# Altium schematic sheet ITCoffeeOne_Lite_V4.02_0.SchDoc: GaggiaBoard_V3
size 274 x 227 mm; Origin: Eagle; Date: 2023-10-17 12:57:02; SheetNumber: 1; GateName_1: G$1; SymbolName_1: LETTER_L; LibraryName: frames; DeviceSetName: LETTER_L; GateName_2: G$2; SymbolName_2: DOCFIELD; Sheet: Sheet:; REV: REV:
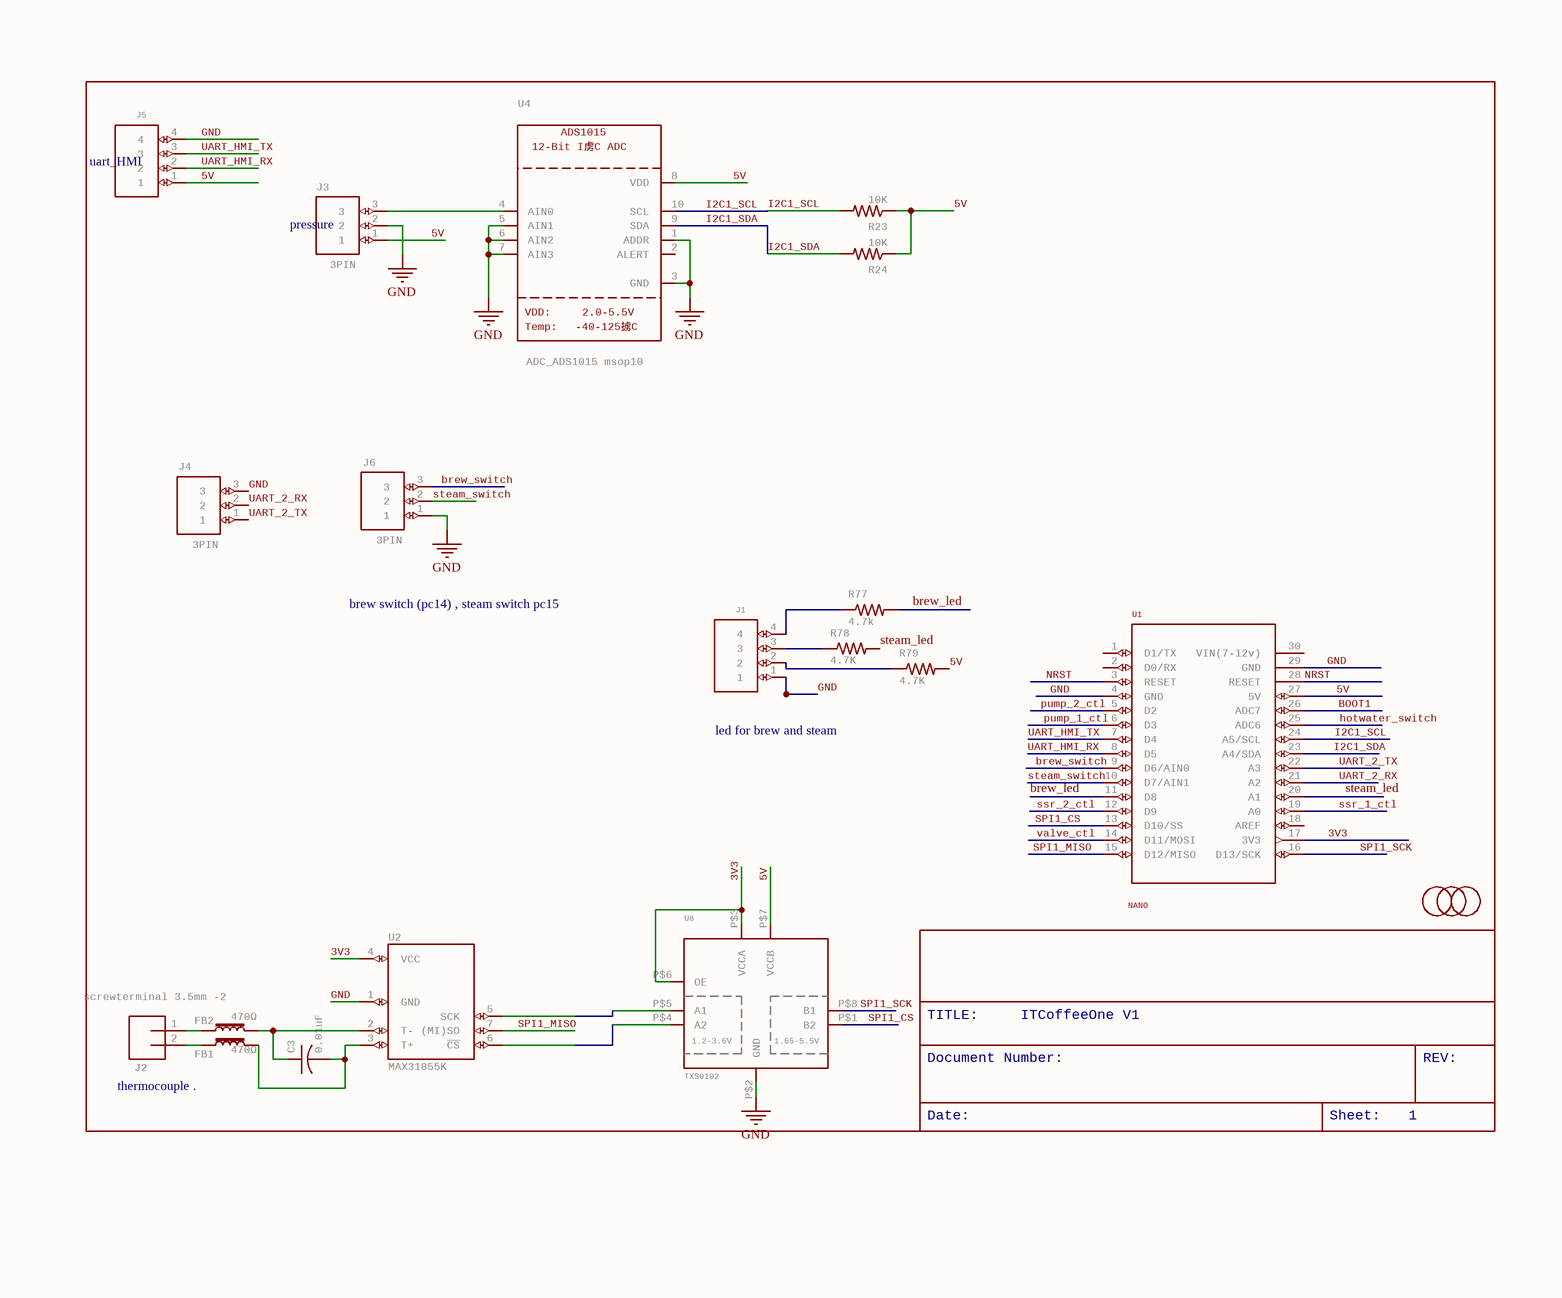
[diagram p0: ITCoffeeOne_Lite_V4.02_0.SchDoc]

## Parts
C3  0.01uF  [C0603]
FB1  470Ω  [0603]
FB2  470Ω  [0603]
J1  4PIN B4B-PH-K-S  [B4B-PH-K-S]  (value not drawn)
J2  screwterminal 3.5mm -2  [SCREWTERMINAL-3.5MM-2-NS]
J3  3PIN  [B3B-PH-K-S]
J4  3PIN  [B3B-PH-K-S]
J5  4PIN B4B-PH-K-S  [B4B-PH-K-S]  (value not drawn)
J6  3PIN  [B3B-PH-K-S]
MARK1  FIDUCIAL  [FIDUCIAL_1MM]  (value not drawn)
MARK2  FIDUCIAL  [FIDUCIAL_1MM]  (value not drawn)
MARK5  FIDUCIAL  [FIDUCIAL_1MM]  (value not drawn)
R23  10K  [R0603]
R24  10K  [R0603]
R77  4.7k  [R0603]
R78  4.7K  [R0603]
R79  4.7K  [R0603]
U1  NANO  [ARDUINO NANO]
U2  MAX31855K  [SO08]
U4  ADC_ADS1015 msop10  12-BitI虏CADC: 12-Bit I虏C ADC  VDD: VDD:  Temp: Temp:  [MSOP10]
U8  TXS0102  [VFSOP-8]

## Nets
GND: J1.1 J3.2 J4.3 J5.4 J6.1 U1.4(GND) U1.29(GND) U2.1(GND) U4.1(ADDR) U4.3(GND) U4.5(AIN1) U4.6(AIN2) U4.7(AIN3) U8.P$2(GND)
3V3: U1.17(3V3) U2.4(VCC) U8.P$3(VCCA) U8.P$6(OE)
5V: J3.1 J5.1 R23.1 R24.1 R79.2 U1.27(5V) U4.8(VDD) U8.P$7(VCCB)
BOOT1: U1.26(ADC7)
brew_led: R77.2 U1.11(D8)
brew_switch: J6.3 U1.9(D6/AIN0)
hotwater_switch: U1.25(ADC6)
I2C1_SCL: R23.2 U1.24(A5/SCL) U4.10(SCL)
I2C1_SDA: R24.2 U1.23(A4/SDA) U4.9(SDA)
NRST: U1.3(RESET) U1.28(RESET)
pump_1_ctl: U1.6(D3)
pump_2_ctl: U1.5(D2)
SPI1_CS: U1.13(D10/SS) U8.P$1(B2)
SPI1_MISO: U1.15(D12/MISO) U2.7((MI)SO)
SPI1_SCK: U1.16(D13/SCK) U8.P$8(B1)
ssr_1_ctl: U1.19(A0)
ssr_2_ctl: U1.12(D9)
steam_led: R78.2 U1.20(A1)
steam_switch: J6.2 U1.10(D7/AIN1)
UART_2_RX: J4.2 U1.21(A2)
UART_2_TX: J4.1 U1.22(A3)
UART_HMI_RX: J5.2 U1.8(D5)
UART_HMI_TX: J5.3 U1.7(D4)
valve_ctl: U1.14(D11/MOSI)
NetC3_1: C3.1 FB2.2 U2.2(T-)
NetC3_2: C3.2 FB1.2 U2.3(T+)
NetFB1_1: FB1.1 J2.2
NetFB2_1: FB2.1 J2.1
NetJ1_2: J1.2 R79.1
NetJ1_3: J1.3 R78.1
NetJ1_4: J1.4 R77.1
NetJ3_3: J3.3 U4.4(AIN0)
NetU2_5: U2.5(SCK) U8.P$5(A1)
NetU2_6: U2.6(~{CS}) U8.P$4(A2)

Not connected (* = marked no-connect by the designer): U1 1(D1/TX) 2(D0/RX) 18(AREF) 30(VIN(7-12v)); U4 2(ALERT)

## Notes on the sheet
- (near J5) uart_HMI
- (near J3) pressure
- brew switch (pc14) , steam switch pc15
- led for brew and steam
- TITLE:
- ITCoffeeOne V1
- thermocouple .
- Document Number:
- REV:
- Date:
- Sheet:
- 1

## Library data of the parts
C3 = C-USC0603: CAPACITOR, American symbol; GateName_1: G$1; SymbolName_1: C-US; POPULARITY: 37; DeviceName: C0603; LibraryName: rcl; DeviceSetName: C-US; LCSC: C100042; SPICEPREFIX: C
FB1 FB2 = FERRITE_BEAD-0603-470Ω-100MHZ-1A-200MILIΩ: Ferrite Bead (blocks, cores, rings, chokes, etc.)    Inductor with layers of ferrite used to suppress high frequencies. Often used to isolate high frequency noise.   SparkFun Products:  IOIO-OTG - V2.2  SparkFun SAMD21 Mini Breakout  SparkFun 6 Degrees of Freedom Breakout - LSM6DS3  SparkFun SAMD21 Dev Breakout; GateName_1: G$1; PROD_ID: NDUC-12579; SymbolName_1: FERRITE_BEAD; DeviceName: -0603-470Ω-100MHZ-1A-200MILIΩ; LibraryName: SparkFun-Coils; DeviceSetName: FERRITE_BEAD; LCSC: C883591
J1 J5 = 4PIN: GateName_1: G$1; SymbolName_1: 4PIN; LibraryName: jst_eph; DeviceSetName: 4PIN; LCSC: C131334
J2 = CONN_023.5MM-NO_SILK: Multi connection point. Often used as Generic Header-pin footprint for 0.1 inch spaced/style header connections    On any of the 0.1 inch spaced packages, you can populate with these:  Break Away Headers - Straight (PRT-00116)   Break Away Male Headers - Right Angle (PRT-00553)   Female Headers (PRT-00115)   Break Away Headers - Machine Pin (PRT-00117)   Break Away Female Headers - Swiss Machine Pin (PRT-00743)        For SCREWTERMINALS and SPRING TERMINALS visit here:  Screw Terimnals on SparkFun.com (5mm/3.5mm/2.54mm spacing)       This device is also useful as a general connection point to wire up your design to another part of your project. Our various solder wires solder well into these plated through hole pads.  Hook-Up Wire - Assortment (Stranded, 22 AWG) (PRT-11375)   Hook-Up Wire - Assortment (Solid Core, 22 AWG) (PRT-11367)   View the entire wire category on our website here          Special notes: Molex polarized connector foot print use with: PRT-08233 with associated crimp pins and housings.  2.54_SCREWTERM for use with  PRT-10571.  3.5mm Screw Terminal footprints for  PRT-08084  5mm Screw Terminal footprints for use with PRT-08432; GateName_1: G$1; PROD_ID: CONN-08399; SymbolName_1: CONN_02; DeviceName: 3.5MM-NO_SILK; LibraryName: SparkFun-Connectors; DeviceSetName: CONN_02; LCSC: C474892
J3 = 3PIN: GateName_1: G$1; SymbolName_1: 3PIN; LibraryName: jst_eph; DeviceSetName: 3PIN; LCSC: C131339
J4 J6 = 3PIN: jst connector，3pin,2.0mm; GateName_1: G$1; SymbolName_1: 3PIN; LibraryName: jst_eph; DeviceSetName: 3PIN; LCSC: C131339
MARK1 MARK2 MARK5 = FIDUCIAL: For use by pick and place machines to calibrate the vision/machine, 1mm    By microbuilder.eu; GateName_1: G$1; SymbolName_1: DOT; LibraryName: adafruit; DeviceSetName: FIDUCIAL
R23 R24 R77-R79 = R-US_R0603: RESISTOR, American symbol; GateName_1: G$1; SymbolName_1: R-US; DeviceSetName: R-US_; POPULARITY: 77; DeviceName: R0603; LibraryName: rcl; LCSC: C98220; SPICEPREFIX: R
U1 = arduino nano: GateName_1: G$1; SymbolName_1: NANO; LibraryName: discrete; DeviceSetName: NANO
U2 = MAX31855K: Cold-Junction-Compensated K-Thermocoupleto-Digital Converter (-270掳C to +1800掳C)    The MAX31855K performs cold-junction compensation and digitizes the signal from a type-K thermocouple. The data is output in a 14-bit resolution, SPI鈩?compatible, read-only format. This converter resolves temperatures to 0.25掳C, allows readings as high as +1800掳C and as low as -270掳C, and exhibits thermocouple accuracy of 卤2掳C for temperatures ranging from -200掳C to +700掳C for K-type thermocouples.   Datasheet SparkFun Products  SparkFun Thermocouple Breakout - MAX31855K (SEN-13266); GateName_1: G$1; PROD_ID: IC-12578; SymbolName_1: MAX31855K; LibraryName: SparkFun-IC-Conversion; DeviceSetName: MAX31855K; LCSC: C52028
U4 = ADC_ADS1015: ADS1015 - 12-bit 4-Channel I2C ADC with Internal PGA    VDD: 2.0-5.5V  Sampling Rate: 3.3ksps  Gain Settings: 2/3, 1, 2, 4, 8, 16  I2C Address: ADDR low = 1001000x, ADDR high = 1001001x       Internal Comparator   The ADS1015 includes an internal comparator that can be set to output a high-level on ALERT when the conversion results exceeeds a pre-defined upper level, and will deassert itself when the level falls below a pre-defined lower threshold level. It can also be set to windowed mode where the ALERT pin will be asserted if the data exceeds the upper threshold or falls below the lower threshold.; GateName_1: G$1; SymbolName_1: ADS1015; LibraryName: microbuilder; DeviceSetName: ADC_ADS1015; ADS1015: ADS1015; 2.0-5.5V: 2.0-5.5V; -40-125掳C: -40-125掳C; LCSC: C193969
U8 = TXS0102: 2-Bit Bi-Directional Level Shifter (I2C, etc.)   Designed for I2C devices and has internal pullups.  Not to be confused with TXB010x series.   1.2V-3.6V (VCCA) to 1.65V-5.5V (VCCB) bi-directional level shifter with auto direction sensing.    Max data rate - 24Mbps (Push Pull), 2Mbps (Open Drain)       Digikey: 296-21931-1-ND; GateName_1: G$1; SymbolName_1: TXS0102; LibraryName: adafruit; DeviceSetName: TXS0102; 1.2-3.6V: 1.2-3.6V; 1.65-5.5V: 1.65-5.5V; LCSC: C53434